# Altium schematic sheet 222222 copy_2021-12-02.schdoc
size 296 x 213 mm
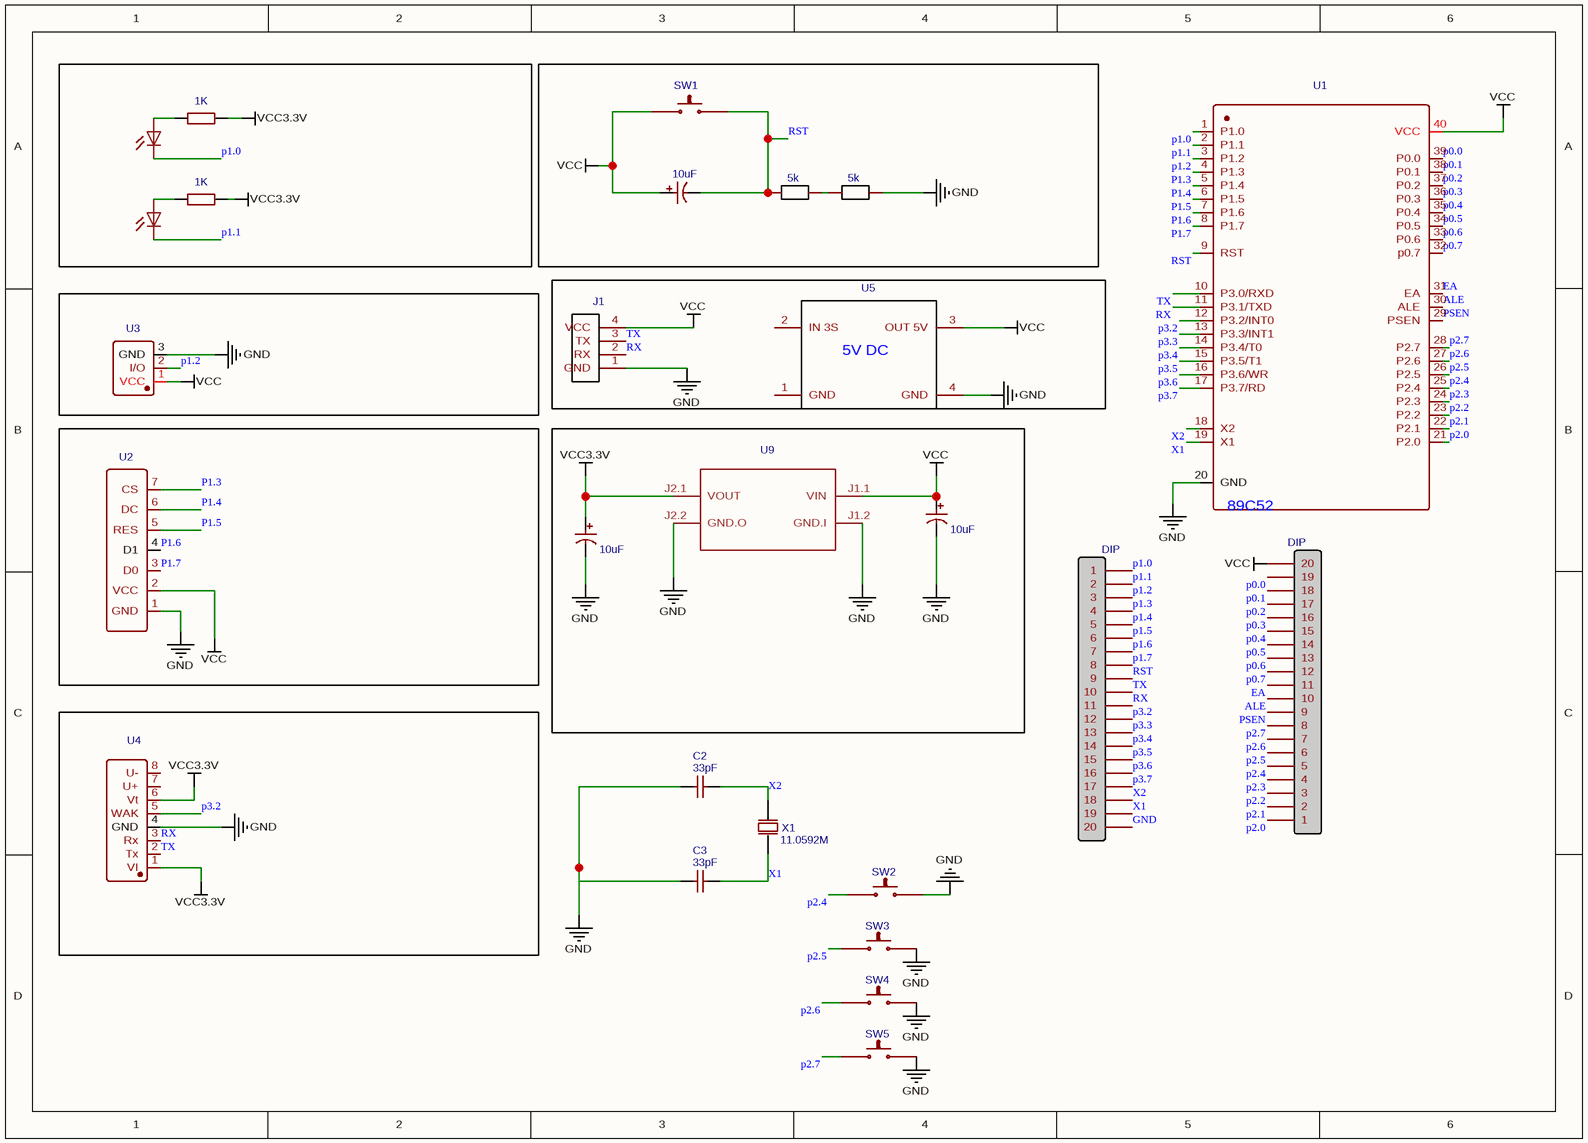
[diagram p0: 222222 copy_2021-12-02.schdoc]

## Parts
1  DIP  [DIP-2.54-20X1]
2  DIP  [DIP-2.54-20X1]
C1  10uF  [CAP-TH_BD5.0-P2.00-D0.8-FD]
C2  33pF  [RAD-0.1]
C3  33pF  [RAD-0.1]
C4  10uF  [CAP-TH_BD5.0-P2.00-D0.8-FD]
C5  10uF  [CAP-TH_BD5.0-P2.00-D0.8-FD]
J1  排针  [我的PCB库]  (value not drawn)
LED1  LED_LED3MM  [LED_LED3MM]  (value not drawn)
LED2  LED_LED3MM  [LED_LED3MM]  (value not drawn)
R1  5k  [电阻]
R3  5k  [电阻]
SW1  SW  [SW-DIP-4P-L6.0-P4.5-W6.0-LS6.5]  (value not drawn)
SW2  SW2  [SW-DIP-4P-L6.0-P4.5-W6.0-LS6.5]
SW3  SW3  [SW-DIP-4P-L6.0-P4.5-W6.0-LS6.5]
SW4  SW4  [SW-DIP-4P-L6.0-P4.5-W6.0-LS6.5]
SW5  SW5  [SW-DIP-4P-L6.0-P4.5-W6.0-LS6.5]
U1  单片机芯片元件03边一凡  [STC89C52RC]  (value not drawn)
U2  OLED-7PIN  [OLED-7PIN]  (value not drawn)
U3  有源蜂鸣器 COPY  [有源蜂鸣器]  (value not drawn)
U4  AS608  [AS608]  (value not drawn)
U5  5V DC电源模块  [电源模块]  (value not drawn)
U6  1K电阻原理图  [1K电阻PCB]  (value not drawn)
U7  1K电阻原理图  [1K电阻PCB]  (value not drawn)
U9  REG-AMS1117-3.3V  [REG-AMS1117]  (value not drawn)
X1  11.0592M  [11.0592M]

## Nets
GND: 1.20 C2.1 C3.1 C4.2 C5.2 J1.1(GND) R1.1 SW2.1 SW3.1 SW4.1 SW5.1 U1.20(GND) U2.1(GND) U3.3(GND) U4.4(GND) U5.4(GND) U9.J1.2(GND.I) U9.J2.2(GND.O)
VCC: 2.20 C1.1 C5.1 J1.4(VCC) SW1.2 U1.40(VCC) U2.2(VCC) U3.1(VCC) U5.3(OUT_5V) U9.J1.1(VIN)
VCC3.3V: C4.1 U4.1(VI) U4.6(Vt) U6.2 U7.2 U9.J2.1(VOUT)
ALE: 2.10 U1.30(ALE)
EA: 2.11 U1.31(EA)
p0.0: 2.19 U1.39(P0.0)
p0.1: 2.18 U1.38(P0.1)
p0.2: 2.17 U1.37(P0.2)
p0.3: 2.16 U1.36(P0.3)
p0.4: 2.15 U1.35(P0.4)
p0.5: 2.14 U1.34(P0.5)
p0.6: 2.13 U1.33(P0.6)
p0.7: 2.12 U1.32(p0.7)
p1.0: 1.1 LED1.K(C) U1.1(P1.0)
p1.1: 1.2 LED2.K(C) U1.2(P1.1)
p1.2: 1.3 U1.3(P1.2) U3.2(I/O)
P1.3: 1.4 U1.4(P1.3) U2.7(CS)
P1.4: 1.5 U1.5(P1.4) U2.6(DC)
P1.5: 1.6 U1.6(P1.5) U2.5(RES)
P1.6: 1.7 U1.7(P1.6) U2.4(D1)
P1.7: 1.8 U1.8(P1.7) U2.3(D0)
p2.0: 2.1 U1.21(P2.0)
p2.1: 2.2 U1.22(P2.1)
p2.2: 2.3 U1.23(P2.2)
p2.3: 2.4 U1.24(P2.3)
p2.4: 2.5 SW2.2 U1.25(P2.4)
p2.5: 2.6 SW3.2 U1.26(P2.5)
p2.6: 2.7 SW4.2 U1.27(P2.6)
p2.7: 2.8 SW5.2 U1.28(P2.7)
p3.2: 1.12 U1.12(P3.2/INT0) U4.5(WAK)
p3.3: 1.13 U1.13(P3.3/INT1)
p3.4: 1.14 U1.14(P3.4/T0)
p3.5: 1.15 U1.15(P3.5/T1)
p3.6: 1.16 U1.16(P3.6/WR)
p3.7: 1.17 U1.17(P3.7/RD)
PSEN: 2.9 U1.29(PSEN)
RST: 1.9 C1.2 R3.2 SW1.1 U1.9(RST)
RX: 1.11 J1.2(RX) U1.11(P3.1/TXD) U4.3(Rx)
TX: 1.10 J1.3(TX) U1.10(P3.0/RXD) U4.2(Tx)
X1: 1.19 C3.2 U1.19(X1) X1.2(OSC2)
X2: 1.18 C2.2 U1.18(X2) X1.1(OSC1)
NetLED1_A: LED1.A U6.1
NetLED2_A: LED2.A U7.1
NetR1_2: R1.2 R3.1

Not connected (* = marked no-connect by the designer): U4 7(U+) 8(U-); U5 1(GND) 2(IN_3S)

## Notes on the sheet
- (in symbol 1K电阻原理图) 1K
- (in symbol 5V DC电源模块) 5V DC
- (in symbol 单片机芯片元件03边一凡) 89C52

## Library data of the parts
1 2 = DIP: Contributor: Excalibur; BOM_Supplier: 望羲电子; spicePre: J; spiceSymbolName: DIP-20P
C1 C4 C5 = 10uF: BOM_Manufacturer: ValuePro; BOM_Manufacturer Part: 0.33uF 50V 5*11; nameAlias: Capacitance; BOM_Supplier: LCSC; BOM_Supplier Part: C45097; BOM_JLCPCB Part Class: Extended Part; spicePre: C; spiceSymbolName: 0.33UF 50V 5*11
C2 C3 = 33pF: BOM_Manufacturer: LCSC; BOM_Manufacturer Part: 33pf/50V 10%; nameAlias: Value; BOM_Supplier: LCSC; BOM_Supplier Part: C9318; spicePre: C; spiceSymbolName: 33pF直插瓷片电容
J1 = 排针: Contributor: TOMMY; BOM_Manufacturer Part: 排针; spicePre: J; spiceSymbolName: 排针
LED1 LED2 = LED_LED3MM: description: LED; timeStamp: 1472857558; spicePre: L; spiceSymbolName: LED_LED3MM
R1 R3 = 5k: Contributor: gank; spicePre: R; spiceSymbolName: 电阻
SW1 = SW: BOM_Manufacturer: Dongguan Guangzhu Industrial; BOM_Manufacturer Part: C13828; Contributor: hhdsdy; BOM_Supplier: LCSC; BOM_Supplier Part: C13828; spicePre: S; spiceSymbolName: SW
SW2 = SW2: BOM_Manufacturer: Dongguan Guangzhu Industrial; BOM_Manufacturer Part: C13828; Contributor: hhdsdy; BOM_Supplier: LCSC; BOM_Supplier Part: C13828; spicePre: S; spiceSymbolName: SW
SW3 = SW3: BOM_Manufacturer: Dongguan Guangzhu Industrial; BOM_Manufacturer Part: C13828; Contributor: hhdsdy; BOM_Supplier: LCSC; BOM_Supplier Part: C13828; spicePre: S; spiceSymbolName: SW
SW4 = SW4: BOM_Manufacturer: Dongguan Guangzhu Industrial; BOM_Manufacturer Part: C13828; Contributor: hhdsdy; BOM_Supplier: LCSC; BOM_Supplier Part: C13828; spicePre: S; spiceSymbolName: SW
SW5 = SW5: BOM_Manufacturer: Dongguan Guangzhu Industrial; BOM_Manufacturer Part: C13828; Contributor: hhdsdy; BOM_Supplier: LCSC; BOM_Supplier Part: C13828; spicePre: S; spiceSymbolName: SW
U1 = 单片机芯片元件03边一凡: Contributor: bianyifan; spicePre: U; spiceSymbolName: 单片机芯片元件03边一凡
U2 = OLED-7PIN: Contributor: z2047124959; spicePre: U; spiceSymbolName: OLED-7PIN
U3 = 有源蜂鸣器 COPY: Contributor: henji; Package Display: No; spicePre: U; spiceSymbolName: 有源蜂鸣器 COPY
U4 = AS608: Contributor: LAOPAI; spicePre: U; spiceSymbolName: AS608
U5 = 5V DC电源模块: Contributor: CyberPin; spicePre: U; spiceSymbolName: 5V DC电源模块
U6 U7 = 1K电阻原理图: BOM_Manufacturer Part: New SchematicLib; Contributor: qwerasdf; spicePre: U; spiceSymbolName: 1K电阻原理图
U9 = REG-AMS1117-3.3V: description: Linear Regulator based on AMS1117 chip; spicePre: U; spiceSymbolName: REG-AMS1117-3.3V
X1 = 11.0592M: Contributor: sanshengsan; BOM_Supplier: X; spicePre: X; spiceSymbolName: 11.0592M